# Altium schematic sheet Voltage Regulation.SchDoc
size A4; SheetNumber: 5; SheetTotal: 6
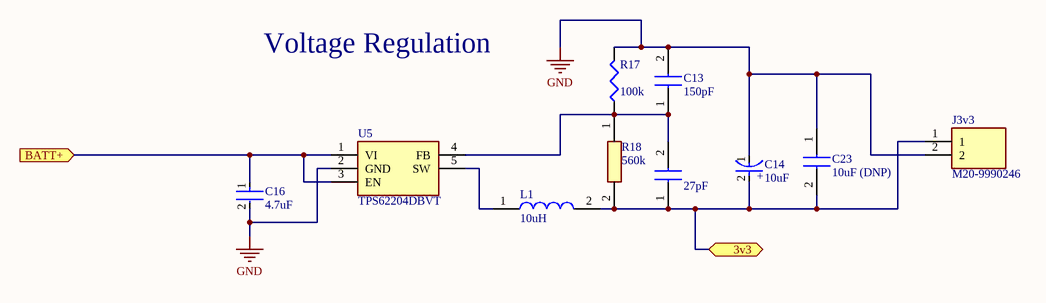
[diagram p0: Voltage Regulation.SchDoc]

## Parts
C13  150pF  [CAPC1608X90N]
C14  10uF  [FP-TAJS-MFG]
C16  4.7uF  [FP-1206-L_3_2_0_2-W_1_6_0-IPC_B]
C23  10uF (DNP)  [CAPC1608X90N]
J3v3  M20-9990246  [HDRV2W66P0X254_1X2_508X254X874P]
L1  10uH  [AISC1008F100GT]
R17  value 100k  [J1-0603]  (hidden comment: Res3)
R18  560k  [ERJS06_U06_(0805)]
U5  TPS62204DBVT  [SOT95P280X145-5N]
  27pF  [C0603]

## Ports
3v3 (bidir), BATT+ (in)

## Nets
GND: C13.2 C14.1(C) C16.2 C23.1 J3v3.2 R17.2 U5.2(GND)
3v3: C14.2(A) C23.2 J3v3.1 L1.2 R18.2 .1 ; port 3v3
BATT+: C16.1 U5.1(VI) U5.3(EN) ; port BATT+
NetC13_1: C13.1 R17.1 R18.1 U5.4(FB) .2
NetL1_1: L1.1 U5.5(SW)

## Notes on the sheet
- Voltage Regulation
- (in symbol CMP-04424-000459-1) +

## Library data of the parts
C13 = CL10C151JB8NNNC: Capacitor, CL10C151JB8NNNC, 150pF; Manufacturer_Name: Samsung Electro-Mechanics; Datasheet Link: https://datasheet.datasheetarchive.com/originals/dk/DKDS-19/373912.pdf; Height: 0.9mm; Manufacturer_Part_Number: CL10C151JB8NNNC; Mouser Part Number: 187-CL10C151JB8NNNC; Mouser Price/Stock: https://www.mouser.co.uk/ProductDetail/Samsung-Electro-Mechanics/CL10C151JB8NNNC?qs=349EhDEZ59rP%2F9hZgT8P9g%3D%3D; Arrow Part Number: CL10C151JB8NNNC; Arrow Price/Stock: https://www.arrow.com/en/products/cl10c151jb8nnnc/samsung-electro-mechanics
C14 = CMP-04424-000459-1: 10uF 2.5V  ±10% 8Ω 1206  SMD Tantalum Capacitor, TAJS106K002RNJ; Dissipation Factor: 6%; ESR (Equivalent Series Resistance): 8R; Lead Diameter: 1.2mm; Leakage Current: 500nA; Dielectric Material: Tantalum; Voltage Rating (DC): 2.5V; Weight: 0.000571oz; Tolerance: 10%; REACH SVHC: No SVHC; RoHS Compliant: Yes; Case Code (Metric): 3216; Min Operating Temperature: -55°C; Construction: Flat; Voltage Rating: 2.5V; Height: 1.2mm; Max Operating Temperature: 125°C; Case/Package: 1206; Packaging: Tape and Reel; Width: 1.6mm; Radiation Hardening: No; Mount: Surface Mount; Lead Free: Lead Free; Series: TAJ; Termination: SMD/SMT; Lead Pitch: 1.1mm; Depth: 1.6mm; Capacitance: 10uF; Length: 3.2mm; Number of Pins: 2; Voltage: 2.5V; Case Code (Imperial): 1206
C16 = CMP-04427-012562-1: General Purpose Ceramic Capacitor, 1206, 4.7uF, 20%, X5R, 15%, 16V, 1206YD475MAT2A; Dissipation Factor: 5%; Tolerance: 20%; Length: 3.2mm; Min Operating Temperature: -55°C; Width: 0.063inch; Capacitance: 4.7uF; Dielectric: X5R; Case Code (Imperial): 1206; Termination: SMD/SMT; Package Quantity: 1; Depth: 1.6mm; Height: 0.07mm; Voltage Rating: 16V; Mount: Surface Mount; Lead Free: Lead Free; Construction: Flat; Case/Package: 1206; Max Operating Temperature: 85°C; Contact Plating: Tin; Voltage Rating (DC): 16V; Series: -; Case Code (Metric): 3216; RoHS Compliant: Yes; Thickness: 0.07inch; Packaging: Tape and Reel; Number of Pins: 2; Radiation Hardening: No
C23 = CL10A106MQ8NNNC: Capacitor, CL10A106MQ8NNNC; Manufacturer_Name: Samsung Electro-Mechanics; Datasheet Link: http://uk.rs-online.com/web/p/products/7664718; Height: 0.9mm; Manufacturer_Part_Number: CL10A106MQ8NNNC; Mouser Part Number: 187-CL10A106MQ8NNNC; Mouser Price/Stock: https://www.mouser.co.uk/ProductDetail/Samsung-Electro-Mechanics/CL10A106MQ8NNNC?qs=349EhDEZ59qlB6a%2FjjeGAg%3D%3D; Arrow Part Number: CL10A106MQ8NNNC; Arrow Price/Stock: https://www.arrow.com/en/products/cl10a106mq8nnnc/samsung-electro-mechanics?region=nac
J3v3 = M20-9990246: Connector; Manufacturer_Name: Harwin; Datasheet Link: https://cdn.harwin.com/pdfs/M20-999.pdf; Height: 8.74mm; Manufacturer_Part_Number: M20-9990246; Mouser Part Number: 855-M20-9990246; Mouser Price/Stock: https://www.mouser.co.uk/ProductDetail/Harwin/M20-9990246?qs=Jph8NoUxIfWjw4WmyRvzag%3D%3D
L1 = AISC-1008F-100G-T: Inductor, AISC-1008F-100G-T; Manufacturer_Name: ABRACON; Datasheet Link: https://www.mouser.com/datasheet/2/3/AISC-1008(F)-27775.pdf; Height: 2.29mm; Manufacturer_Part_Number: AISC-1008F-100G-T; Mouser Part Number: 815-AISC1008F100GT; Mouser Price/Stock: https://www.mouser.com/Search/Refine.aspx?Keyword=815-AISC1008F100GT; Arrow Part Number: AISC-1008F-100G-T; Arrow Price/Stock: https://www.arrow.com/en/products/aisc-1008f-100g-t/abracon
R17 = Res3: Resistor; Published: 8-Jun-2000; LatestRevisionDate: 29-May-2009; LatestRevisionNote: IPC-7351 Footprint Added.; PackageReference: J1-0603; Publisher: Altium Limited; PackageDescription: Chip Resistor
R18 = ERJ-U06F5603V: Resistor, ERJ-U06F5603V, 560k; Manufacturer_Name: Panasonic; Datasheet Link: https://industrial.panasonic.com/cdbs/www-data/pdf/RDP0000/AOA0000C334.pdf; Height: 0.7mm; Manufacturer_Part_Number: ERJ-U06F5603V; Mouser Part Number: 667-ERJ-U06F5603V; Mouser Price/Stock: http://www.mouser.com/Search/ProductDetail.aspx?qs=Yyy8avaXlIvDfDSBlVZXaA%3d%3d
U5 = TPS62204DBVT: Integrated Circuit; Manufacturer_Name: Texas Instruments; Datasheet Link: http://www.ti.com/lit/gpn/tps62204; Height: 1.45mm; Manufacturer_Part_Number: TPS62204DBVT; Mouser Part Number: 595-TPS62204DBVT; Mouser Price/Stock: https://www.mouser.com/Search/Refine.aspx?Keyword=595-TPS62204DBVT; Arrow Part Number: TPS62204DBVT; Arrow Price/Stock: https://www.arrow.com/en/products/tps62204dbvt/texas-instruments
 = C0603C270J5GAC7411: Capacitor, C0603C270J5GAC7411, 27pF; Manufacturer_Name: KEMET; Datasheet Link: https://content.kemet.com/datasheets/KEM_C1003_C0G_SMD.pdf; Height: 0.87mm; Manufacturer_Part_Number: C0603C270J5GAC7411